# Altium schematic sheet MCU.SchDoc
size A4
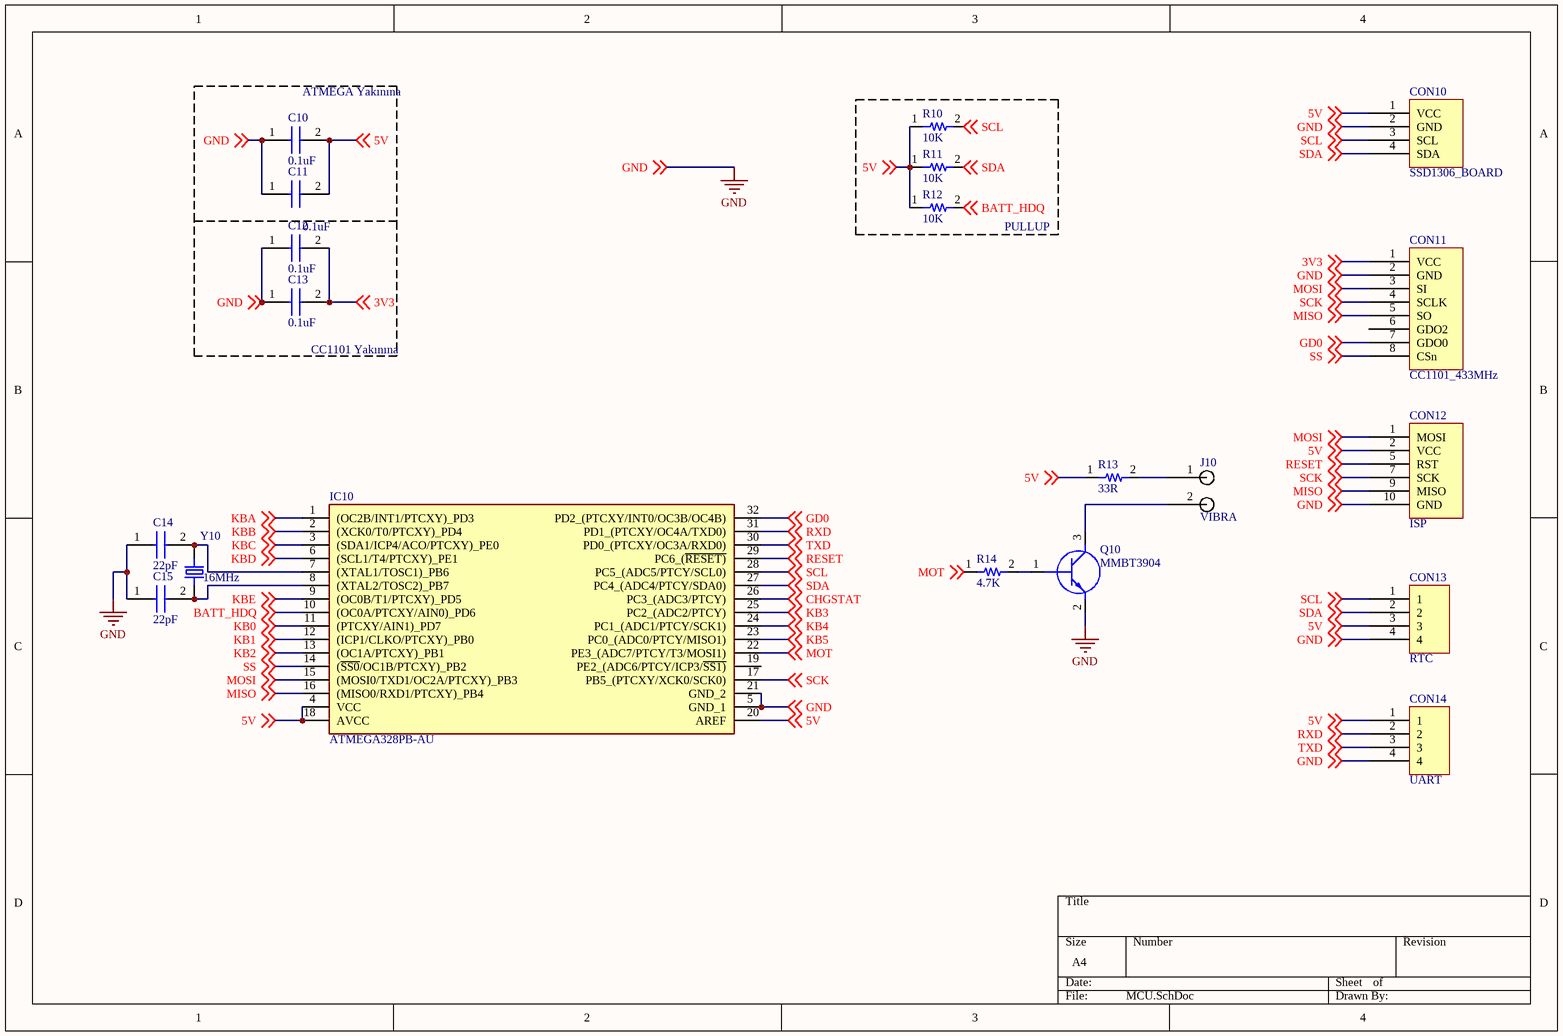
[diagram p0: MCU.SchDoc]

## Parts
C10  0.1uF  [0603 Capacitor]
C11  0.1uF  [0603 Capacitor]
C12  0.1uF  [0603 Capacitor]
C13  0.1uF  [0603 Capacitor]
C14  22pF  [0603 Capacitor]
C15  22pF  [0603 Capacitor]
CON10  SSD1306_BOARD  [SSD1306_PCB]
CON11  CC1101_433MHz  [CC1101_433MHz]
CON12  ISP  [ISP]
CON13  RTC  [JumperHDR4]
CON14  UART  [JumperHDR4]
IC10  ATMEGA328PB-AU  [328PB-AU]
J10  VIBRA  [JumperHDR]
Q10  MMBT3904  [SOT95P240X120-3N]
R10  10K  [0603 Resistor]
R11  10K  [0603 Resistor]
R12  10K  [0603 Resistor]
R13  33R  [0603 Resistor]
R14  4.7K  [0603 Resistor]
Y10  value 16MHz  [Crystal-HC49]

## Blocks framed on the sheet
ATMEGA Yakınına: C10 C11
PULLUP: R10-R12
CC1101 Yakınına: C12 C13

## Nets
GND: C10.1 C11.1 C12.1 C13.1 C14.1 C15.1 CON10.2(GND) CON11.2(GND) CON12.10(GND) CON13.4 CON14.4 IC10.5(GND_1) IC10.21(GND_2) Q10.2(E) ; off-sheet GND
3V3: C12.2 C13.2 CON11.1(VCC) ; off-sheet 3V3
5V: C10.2 C11.2 CON10.1(VCC) CON12.2(VCC) CON13.3 CON14.1 IC10.4(VCC) IC10.18(AVCC) IC10.20(AREF) R10.1 R11.1 R12.1 R13.1 ; off-sheet 5V
BATT_HDQ: IC10.10((OC0A/PTCXY/AIN0)_PD6) R12.2 ; off-sheet BATT_HDQ
CHGSTAT: IC10.26(PC3_(ADC3/PTCY)) ; off-sheet CHGSTAT
GD0: CON11.7(GDO0) IC10.32(PD2_(PTCXY/INT0/OC3B/OC4B)) ; off-sheet GD0
KB0: IC10.11((PTCXY/AIN1)_PD7) ; off-sheet KB0
KB1: IC10.12((ICP1/CLKO/PTCXY)_PB0) ; off-sheet KB1
KB2: IC10.13((OC1A/PTCXY)_PB1) ; off-sheet KB2
KB3: IC10.25(PC2_(ADC2/PTCY)) ; off-sheet KB3
KB4: IC10.24(PC1_(ADC1/PTCY/SCK1)) ; off-sheet KB4
KB5: IC10.23(PC0_(ADC0/PTCY/MISO1)) ; off-sheet KB5
KBA: IC10.1((OC2B/INT1/PTCXY)_PD3) ; off-sheet KBA
KBB: IC10.2((XCK0/T0/PTCXY)_PD4) ; off-sheet KBB
KBC: IC10.3((SDA1/ICP4/ACO/PTCXY)_PE0) ; off-sheet KBC
KBD: IC10.6((SCL1/T4/PTCXY)_PE1) ; off-sheet KBD
KBE: IC10.9((OC0B/T1/PTCXY)_PD5) ; off-sheet KBE
MISO: CON11.5(SO) CON12.9(MISO) IC10.16((MISO0/RXD1/PTCXY)_PB4) ; off-sheet MISO
MOSI: CON11.3(SI) CON12.1(MOSI) IC10.15((MOSI0/TXD1/OC2A/PTCXY)_PB3) ; off-sheet MOSI
MOT: IC10.22(PE3_(ADC7/PTCY/T3/MOSI1)) R14.1 ; off-sheet MOT
RESET: CON12.5(RST) IC10.29(PC6_(~{RESET)}) ; off-sheet RESET
RXD: CON14.2 IC10.31(PD1_(PTCXY/OC4A/TXD0)) ; off-sheet RXD
SCK: CON11.4(SCLK) CON12.7(SCK) IC10.17(PB5_(PTCXY/XCK0/SCK0)) ; off-sheet SCK
SCL: CON10.3(SCL) CON13.1 IC10.28(PC5_(ADC5/PTCY/SCL0)) R10.2 ; off-sheet SCL
SDA: CON10.4(SDA) CON13.2 IC10.27(PC4_(ADC4/PTCY/SDA0)) R11.2 ; off-sheet SDA
SS: CON11.8(CSn) IC10.14((~{SS0}/OC1B/PTCXY)_PB2) ; off-sheet SS
TXD: CON14.3 IC10.30(PD0_(PTCXY/OC3A/RXD0)) ; off-sheet TXD
NetC14_2: C14.2 IC10.7((XTAL1/TOSC1)_PB6) Y10.2
NetC15_2: C15.2 IC10.8((XTAL2/TOSC2)_PB7) Y10.1
NetJ10_1: J10.1 R13.2
NetJ10_2: J10.2 Q10.3(C)
NetQ10_1: Q10.1(B) R14.2

Not connected (* = marked no-connect by the designer): CON11 6(GDO2); IC10 19(PE2_(ADC6/PTCY/ICP3/~{SS1)})

## Library data of the parts
C10-C15 = 0603 Capacitor: Capacitor; Manufacturer_Name: AVX; Manufacturer_Part_Number: 06031A120JAT2A; Datasheet Link: http://www.mouser.com/catalog/supplier/library/pdf/AVXSurfaceMountCeramic.pdf; Height: 0.9mm; Mouser Part Number: 581-06031A120J; Mouser Price/Stock: https://www.mouser.co.uk/ProductDetail/AVX/06031A120JAT2A?qs=tMrmimOZp5UsY%252BxF6dNGxQ%3D%3D; Arrow Part Number: 06031A120JAT2A; Arrow Price/Stock: https://www.arrow.com/en/products/06031a120jat2a/avx
CON12 = ISP: pin to pad: 10>4
CON13 CON14 = JumperHDR4
IC10 = ATMEGA328PB-AU: Integrated Circuit; Manufacturer_Name: Microchip; Datasheet Link: http://www.farnell.com/datasheets/2014286.pdf; Height: 1.2mm; Manufacturer_Part_Number: ATMEGA328PB-AU; Mouser Part Number: 556-ATMEGA328PB-AU; Mouser Price/Stock: https://www.mouser.co.uk/ProductDetail/Microchip-Technology-Atmel/ATMEGA328PB-AU?qs=jy4bLUHv09hbFONgGrqPbw%3D%3D; Arrow Part Number: ATMEGA328PB-AU; Arrow Price/Stock: https://www.arrow.com/en/products/atmega328pb-au/microchip-technology
J10 = JumperHDR_ALT
Q10 = MMBT3904: Transistor BJT NPN; Manufacturer_Name: ON Semiconductor; Datasheet Link: https://media.digikey.com/pdf/Data%20Sheets/ON%20Semiconductor%20PDFs/2N3904,MMBT3904,PZT3904.pdf; Height: 1.2mm; Manufacturer_Part_Number: MMBT3904; Mouser Part Number: 512-MMBT3904; Mouser Price/Stock: https://www.mouser.co.uk/ProductDetail/ON-Semiconductor-Fairchild/MMBT3904?qs=UMEuL5FsraCg3xKjS4uBJQ%3D%3D; Arrow Part Number: MMBT3904; Arrow Price/Stock: https://www.arrow.com/en/products/mmbt3904/on-semiconductor
R10-R14 = 0603 Resistor: Resistor; Manufacturer_Name: TE Connectivity; Manufacturer_Part_Number: CPF0603B100RE1; Datasheet Link: http://www.farnell.com/datasheets/1786775.pdf; Height: 0.55mm; Mouser Part Number: 279-CPF0603B100RE1; Mouser Price/Stock: https://www.mouser.co.uk/ProductDetail/TE-Connectivity-Neohm/CPF0603B100RE1?qs=DfH2yQaBz6s2KWheq2AlNw%3D%3D; Arrow Part Number: CPF0603B100RE1; Arrow Price/Stock: https://www.arrow.com/en/products/cpf0603b100re1/te-connectivity
Y10 = HC49 Crystal: MF: ECS Inc.; MP: ECS-80-18-4XDN; Digi-Key_Part_Number: X1115-ND; Package: HC-49/US ECS International; SnapEDA_Link: https://www.snapeda.com/parts/ECS-80-18-4XDN/ECS%20Inc./view-part/49558/?ref=snap; Digi-Key_Purchase_URL: https://www.digikey.in/product-detail/en/ecs-inc/ECS-80-18-4XDN/X1115-ND/827606?utm_source=snapeda&utm_medium=aggregator&utm_campaign=symbol